# Altium project proLAYOUT_V2.PrjPcb
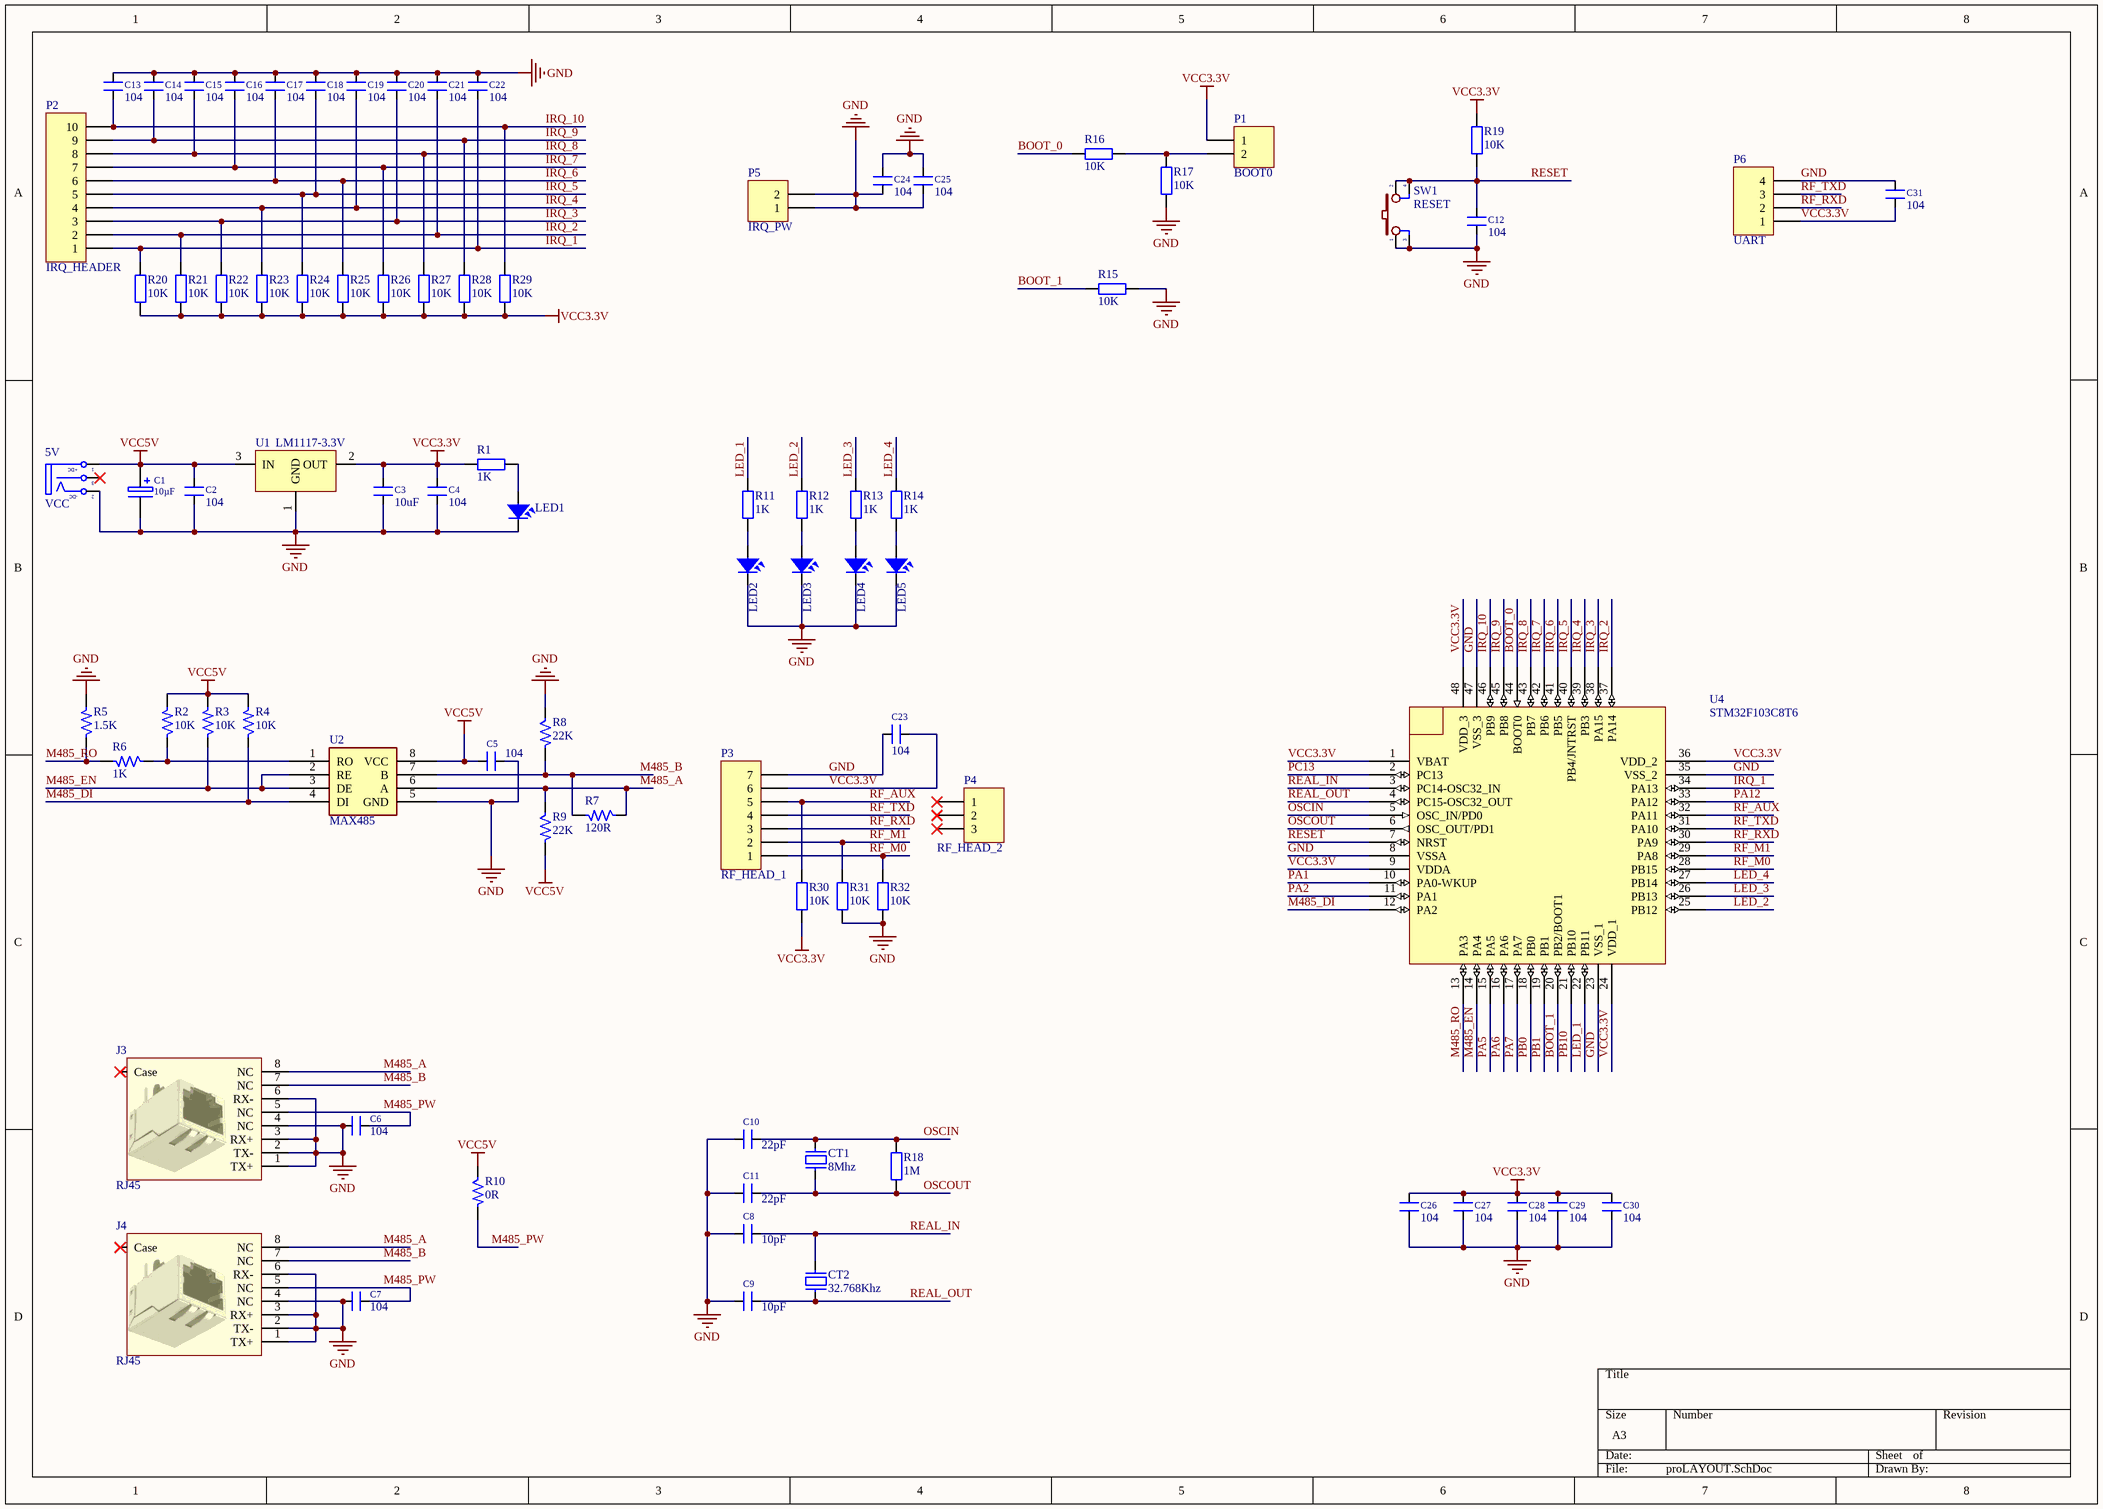
[diagram p0: proLAYOUT.SchDoc]
1 sheet, 83 parts. Net scope: global (net labels, ports and power ports of the same name join across sheets).
Board file: proLAYOUT_V3.PcbDoc

## Sheet proLAYOUT.SchDoc
size A3

### Parts
C1  10µF  [CAP-ALU-SMD-4.5x5x1.4]
C2  104  [SM-CAP-0805]
C3  10uF  [SM-CAP-0805]
C4  104  [SM-CAP-0805]
C5  104  [SM-CAP-0805]
C6  104  [SM-CAP-0805]
C7  104  [SM-CAP-0805]
C8  10pF  [SM-CAP-0805]
C9  10pF  [SM-CAP-0805]
C10  22pF  [SM-CAP-0805]
C11  22pF  [SM-CAP-0805]
C12  104  [SM-CAP-0805]
C13  104  [SM-CAP-0805]
C14  104  [SM-CAP-0805]
C15  104  [SM-CAP-0805]
C16  104  [SM-CAP-0805]
C17  104  [SM-CAP-0805]
C18  104  [SM-CAP-0805]
C19  104  [SM-CAP-0805]
C20  104  [SM-CAP-0805]
C21  104  [SM-CAP-0805]
C22  104  [SM-CAP-0805]
C23  104  [SM-CAP-0805]
C24  104  [SM-CAP-0805]
C25  104  [SM-CAP-0805]
C26  104  [SM-CAP-0805]
C27  104  [SM-CAP-0805]
C28  104  [SM-CAP-0805]
C29  104  [SM-CAP-0805]
C30  104  [SM-CAP-0805]
C31  104  [SM-CAP-0805]
CT1  8Mhz  [CRYSTAL_HC49-US-SM]
CT2  32.768Khz  [CRYSTAL SMD 32,768 kHz]
J3  RJ45  [RJ45 - 18]
J4  RJ45  [RJ45 - 18]
LED1  LED  [L-0805]  (value not drawn)
LED2  LED  [L-0805]  (value not drawn)
LED3  LED  [L-0805]  (value not drawn)
LED4  LED  [L-0805]  (value not drawn)
LED5  LED  [L-0805]  (value not drawn)
P1  BOOT0  [HDR1X2]
P2  IRQ_HEADER  [HDR1X10]
P3  RF_HEAD_1  [HDR1X7]
P4  RF_HEAD_2  [HDR1X3]
P5  IRQ_PW  [HDR1X2]
P6  UART  [HDR1X4]
R1  1K  [SM-0805]
R2  10K  [R-0805]
R3  10K  [R-0805]
R4  10K  [R-0805]
R5  1.5K  [R-0805]
R6  1K  [R-0805]
R7  120R  [R-0805]
R8  22K  [R-0805]
R9  22K  [R-0805]
R10  0R  [R-0805]
R11  1K  [SM-0805]
R12  1K  [SM-0805]
R13  1K  [SM-0805]
R14  1K  [SM-0805]
R15  10K  [SM-0805]
R16  10K  [SM-0805]
R17  10K  [SM-0805]
R18  1M  [SM-0805]
R19  10K  [SM-0805]
R20  10K  [SM-0805]
R21  10K  [SM-0805]
R22  10K  [SM-0805]
R23  10K  [SM-0805]
R24  10K  [SM-0805]
R25  10K  [SM-0805]
R26  10K  [SM-0805]
R27  10K  [SM-0805]
R28  10K  [SM-0805]
R29  10K  [SM-0805]
R30  10K  [SM-0805]
R31  10K  [SM-0805]
R32  10K  [SM-0805]
SW1  RESET  [SW4 CMD M]
U1  LM1117-3.3V  [LM1117-SOP]
U2  MAX485  [SO8W_N]
U4  STM32F103C8T6  [STM32_LQPF48]
VCC  5V  [DC-IN]

### Nets
GND: C1.2 C2.1 C3.1 C4.1 C5.2 C6.1 C7.1 C8.1 C9.1 C10.1 C11.1 C12.1 C13.2 C14.2 C15.2 C16.2 C17.2 C18.2 C19.2 C20.2 C21.2 C22.2 C23.2 C24.1 C24.2 C25.1 C25.2 C26.2 C27.2 C28.2 C29.2 C30.2 C31.2 J3.1(TX+) J3.2(TX-) J3.3(RX+) J3.4(NC) J3.6(RX-) J4.1(TX+) J4.2(TX-) J4.3(RX+) J4.4(NC) J4.6(RX-) LED1.2 LED2.2 LED3.2 LED4.2 LED5.2 P3.7 P5.1 P5.2 P6.4 R5.2 R8.1 R15.1 R17.2 R31.2 R32.2 SW1.1 SW1.3 U1.1(GND) U2.5(GND) U4.8(VSSA) U4.23(VSS_1) U4.35(VSS_2) U4.47(VSS_3) VCC.2(TN)
VCC3.3V: C3.2 C4.2 C23.1 C26.1 C27.1 C28.1 C29.1 C30.1 C31.1 P1.1 P3.6 P6.1 R1.1 R19.1 R20.2 R21.2 R22.2 R23.2 R24.2 R25.2 R26.2 R27.2 R28.2 R29.2 R30.2 U1.2(OUT) U4.1(VBAT) U4.9(VDDA) U4.24(VDD_1) U4.36(VDD_2) U4.48(VDD_3)
VCC5V: C1.1 C2.2 C5.1 R2.2 R3.2 R4.2 R9.2 R10.1 U1.3(IN) U2.8(VCC) VCC.1(T)
BOOT_0: R16.2 U4.44(BOOT0)
BOOT_1: R15.2 U4.20(PB2/BOOT1)
IRQ_1: C22.1 P2.1 R20.1 U4.34(PA13)
IRQ_2: C21.1 P2.2 R21.1 U4.37(PA14)
IRQ_3: C20.1 P2.3 R22.1 U4.38(PA15)
IRQ_4: C19.1 P2.4 R23.1 U4.39(PB3)
IRQ_5: C18.1 P2.5 R24.1 U4.40(PB4/JNTRST)
IRQ_6: C17.1 P2.6 R25.1 U4.41(PB5)
IRQ_7: C16.1 P2.7 R26.1 U4.42(PB6)
IRQ_8: C15.1 P2.8 R27.1 U4.43(PB7)
IRQ_9: C14.1 P2.9 R28.1 U4.45(PB8)
IRQ_10: C13.1 P2.10 R29.1 U4.46(PB9)
LED_1: R11.2 U4.22(PB11)
LED_2: R12.2 U4.25(PB12)
LED_3: R13.2 U4.26(PB13)
LED_4: R14.2 U4.27(PB14)
M485_A: J3.8(NC) J4.8(NC) R7.1 R9.1 U2.6(A)
M485_B: J3.7(NC) J4.7(NC) R7.2 R8.2 U2.7(B)
M485_DI: R4.1 U2.4(DI) U4.12(PA2)
M485_EN: R3.1 U2.2(RE) U2.3(DE) U4.14(PA4)
M485_PW: C6.2 C7.2 J3.5(NC) J4.5(NC) R10.2
M485_RO: R5.1 R6.2 U4.13(PA3)
OSCIN: C10.2 CT1.2 R18.1 U4.5(OSC_IN/PD0)
OSCOUT: C11.2 CT1.1 R18.2 U4.6(OSC_OUT/PD1)
PA1: U4.10(PA0-WKUP)
PA2: U4.11(PA1)
PA5: U4.15(PA5)
PA6: U4.16(PA6)
PA7: U4.17(PA7)
PA12: U4.33(PA12)
PB0: U4.18(PB0)
PB1: U4.19(PB1)
PB10: U4.21(PB10)
PC13: U4.2(PC13)
REAL_IN: C8.2 CT2.2 U4.3(PC14-OSC32_IN)
REAL_OUT: C9.2 CT2.1 U4.4(PC15-OSC32_OUT)
RESET: C12.2 R19.2 SW1.2 SW1.4 U4.7(NRST)
RF_AUX: P3.5 R30.1 U4.32(PA11)
RF_M0: P3.1 R32.1 U4.28(PB15)
RF_M1: P3.2 R31.1 U4.29(PA8)
RF_RXD: P3.3 P6.2 U4.30(PA9)
RF_TXD: P3.4 P6.3 U4.31(PA10)
NetLED1_1: LED1.1 R1.2
NetLED2_1: LED2.1 R11.1
NetLED3_1: LED3.1 R12.1
NetLED4_1: LED4.1 R13.1
NetLED5_1: LED5.1 R14.1
NetP1_2: P1.2 R16.1 R17.1
NetR2_1: R2.1 R6.1 U2.1(RO)

Not connected (* = marked no-connect by the designer): J3 0(Case)*; J4 0(Case)*; P4 1* 2* 3*; VCC 3(S)*

### Notes on the sheet
- (in symbol DCIN) +DC; -DC

### Library data of the parts
C1 = CAP Aluminum
C2 C4-C7 C12-C31 = CAP SMD: Value: 0.1uF; Designed by: VanDungEvn
C3 C8-C11 = CAP SMD: Designed by: VanDungEvn
  C3: Value: 10uF
  C8 C9: Value: 10pF
  C10 C11: Value: 22pF
CT1 CT2 = CRYSTAL: Crystal For all Crystal 2pin.
  CT1: Value: 8Mhz
  CT2: Value: 32.768Khz
J3 J4 = RJ45-LAN: Single RJ45 Connector Non LED
LED1-LED5 = LED: LED Single colour Green and Red; Value: LED 3 ly Single Colour
P1 P5 = Header 2: Header, 2-Pin; LatestRevisionDate: 17-Jul-2002; LatestRevisionNote: Re-released for DXP Platform.; Publisher: Altium Limited
P2 = Header 10: Header, 10-Pin; LatestRevisionDate: 17-Jul-2002; LatestRevisionNote: Re-released for DXP Platform.; Publisher: Altium Limited
P3 = Header 7: Header, 7-Pin; LatestRevisionDate: 17-Jul-2002; LatestRevisionNote: Re-released for DXP Platform.; Publisher: Altium Limited
P4 = Header 3: Header, 3-Pin; LatestRevisionDate: 17-Jul-2002; LatestRevisionNote: Re-released for DXP Platform.; Publisher: Altium Limited
P6 = Header 4: Header, 4-Pin; LatestRevisionDate: 17-Jul-2002; LatestRevisionNote: Re-released for DXP Platform.; Publisher: Altium Limited
R1 R11-R32 = RM: Resistor SMD
  R1 R11-R14: Value: 1K
  R15-R17 R19-R32: Value: 10K
  R18: Value: 1M
R2-R4 R7 R10 = R: Resistor 1/4W
  R2-R4: Value: 10K
  R7: Value: 120R
  R10: Value: 0R
R5 = R: Resistor 1/4W; Value: 5K
R6 R8 R9 = R: Resistor 1/4W; Value: 10K
SW1 = SW4-1: Switch button 4 pin; Value: SW chip 4 pin
U1 = LM1117: 800mA Low-Dropout Linear Regulator; Creator: Nguyen Ba Bien; Website: http://group3i.net
U2 = max485_smd
U4 = STM32F103xx_LQFP48: STM32 ARM-based 32-bit MCU with 64 Kbytes Flash, 48-pin LQFP, Industrial Temperature; Published: 30-May-2008; DatasheetVersion: rev6, Mar-2008; PackageVersion: Mar-2008; PackageReference: LQFP48; Publisher: Altium Limited; PackageDescription: 48-Pin Low-Profile Quad Flat Pack, 7 x 7 mm Body, 0.5 mm Pitch (LQFP48); ComponentLink1Description: Manufacturer Link; ComponentLink1URL: www.st.com/stm32; ComponentLink2Description: Datasheet; ComponentLink2URL: http://www.st.com/stonline/products/literature/ds/13587.pdf
VCC = DCIN